# Altium schematic sheet Power_Supply_Current_Limit.SchDoc
size A4
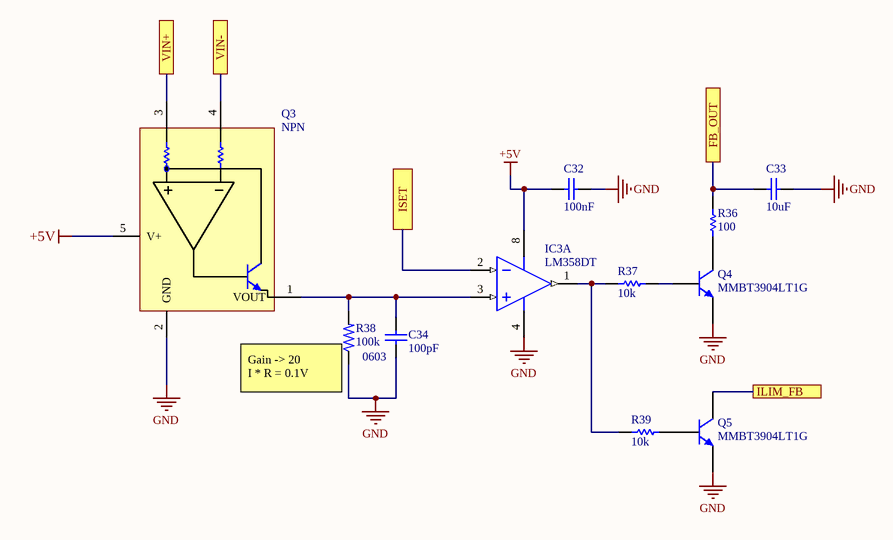
[diagram p0: Power_Supply_Current_Limit.SchDoc]

## Parts
C32  100nF  [CAPC1608X09N]
C33  10uF  [CAPC3216X127X50ML20T25]
C34  100pF  [CAPC1608X09N]
IC3  LM358DT  [SOIC-OA8_M]  (part A of 2)
Q3  NPN  [PCB-h3r3bzz71pyabhalkrge-1]
Q4  MMBT3904LT1G  [SOT-23]
Q5  MMBT3904LT1G  [SOT-23]
R36  100  [gen0603-2]
R37  10k  [gen0603-2]
R38  100k  Package / Case: 0603  [PCB-3elf45qdqizoabmczrxc-1]
R39  10k  [gen0603-2]

## Ports
FB_OUT, ILIM_FB, ISET, VIN+, VIN-

## Nets
+5V: C32.2 IC3.8(VCC) Q3.5(V+)
GND: C32.1 C33.1 C34.1 IC3.4(VEE/GND) Q3.2(GND) Q4.2(E) Q5.2(E) R38.1
FB_OUT: C33.2 R36.2 ; port FB_OUT
ILIM_FB: Q5.3(C) ; port ILIM_FB
ISET: IC3.2(INA-) ; port ISET
VIN+: Q3.3 ; port VIN+
VIN-: Q3.4 ; port VIN-
NetC34_2: C34.2 IC3.3(INA+) Q3.1(VOUT) R38.2
NetIC3_1: IC3.1(OUTA) R37.2 R39.2
NetQ4_1: Q4.1(B) R37.1
NetQ5_1: Q5.1(B) R39.1

Not connected (* = marked no-connect by the designer): Q4 3(C); R36 1

## Notes on the sheet
- (near R38) Gain -> 20
  I * R = 0.1V

## Library data of the parts
C32 = CMP-2f55e5122ad9f092-5: 0603 10 nF 50 V ± 10% Tolerance X7R Surface Mount Multilayer Ceramic Capacitor; Manufacture Part Number: CC0603KRX7R9BB104; Manufacturer: YAGEO; Voltage-Rated: 50V; Capacitance Tolerance: 10%; Capacitance: 100nF; Package / Case: 0603; Supplier: LCSC; Supplier Part Number: C14663
C33 = CMP-126371-4: CAP CER 0.1UF 100V 10% X7R 1206; Manufacturer: Samsung Electro-Mechanics; Manufacture Part Number: CL31B106KBHNNNE; Voltage-Rated: 50V; Supplier: LCSC; Capacitance: 10uF; Package / Case: 1206; Capacitance Tolerance: 10%; Supplier Part Number: C89632
C34 = CMP-2f55e5122ad9f092-5: 0603 10 nF 50 V ± 10% Tolerance X7R Surface Mount Multilayer Ceramic Capacitor; Manufacture Part Number: 0603N101J500CT; Manufacturer: Walsin Tech Corp; Capacitance Tolerance: 5%; Voltage-Rated: 50V; Capacitance: 100pF; Package / Case: 0603; Supplier: LCSC; Supplier Part Number: C335544
IC3 = CMP-9a3c516d515145fb-3: LM358 Series 30 V 1.1 MHz Low Power Dual Operational Amplifier - SOIC-8; Manufacturer: STMicroelectronics; Slew Rate: 600 mV/μs; Number of Channels: 2; Gain Bandwidth Product: 1.10 MHz; Supply Current: 700 µA; Lead-Free Status: Lead Free; Supply Voltage (DC): 32.0 V; Lifecycle Status: Active; REACH SVHC Compliance: No SVHC; Octopart URL: https://octopart.com/lm358dt-stmicroelectronics-39579147; RoHS: Compliant; Number of Pins: 8; Bandwidth: 1.10 MHz; Number of Circuits: 2; Packaging: Cut Tape (CT), Tape & Reel (TR); Mounting Style: Surface Mount; Case/Package: SOIC; OctopartID: 9a3c516d515145fb; Manufacture Part Number: LM358DT; Supplier: LCSC; Supplier Part Number: C9418
Q3 = CMP-0019c915bbf2dfde-3: 36-V, High-Side, Current Output Current Shunt Monitor 5-SOT-23 -40 to 125; Manufacture Part Number: INA138NA/3K; Manufacturer: Texas Instruments; Case/Package: SOT-23; Supplier: LCSC; Supplier Part Number: C47914
Q4 Q5 = CMP-857799-8: MMBT Series 40 V 200 mA SMT NPN Silicon General Purpose Transistor - SOT-23; Manufacturer: ON Semiconductor; Supplier Part Number: C81464; Supplier: LCSC; Manufacture Part Number: MMBT3904LT1G
R36 = CMP-1853278-27: Surface Mount Thick Film Resistor, RC Series, 1 kohm, 100 mW, - 1%, 50 V, 0603 [1608 Metric]; Manufacturer: UNI-ROYAL(Uniroyal Elec); Manufacture Part Number: 0603WAF1000T5E; Resistance Tolerance: 1%; Supplier: LCSC; Supplier Part Number: C22775; Resistance: 100; Package / Case: 0603
R37 R39 = CMP-1853278-27: Surface Mount Thick Film Resistor, RC Series, 1 kohm, 100 mW, - 1%, 50 V, 0603 [1608 Metric]; Manufacturer: YAGEO; Manufacture Part Number: RC0603FR-0710KL; Resistance Tolerance: 1%; Supplier: LCSC; Supplier Part Number: C98220; Resistance: 10k; Package / Case: 0603
R38 = CMP-1853278-23: Surface Mount Thick Film Resistor, RC Series, 1 kohm, 100 mW, - 1%, 50 V, 0603 [1608 Metric]; Manufacturer: Walsin Tech Corp; Manufacture Part Number: WR06X1003FTL; Resistance Tolerance: 1%; Resistance: 100k; Supplier: LCSC; Supplier Part Number: C132374